# Altium schematic sheet main_control.SchDoc
size A4
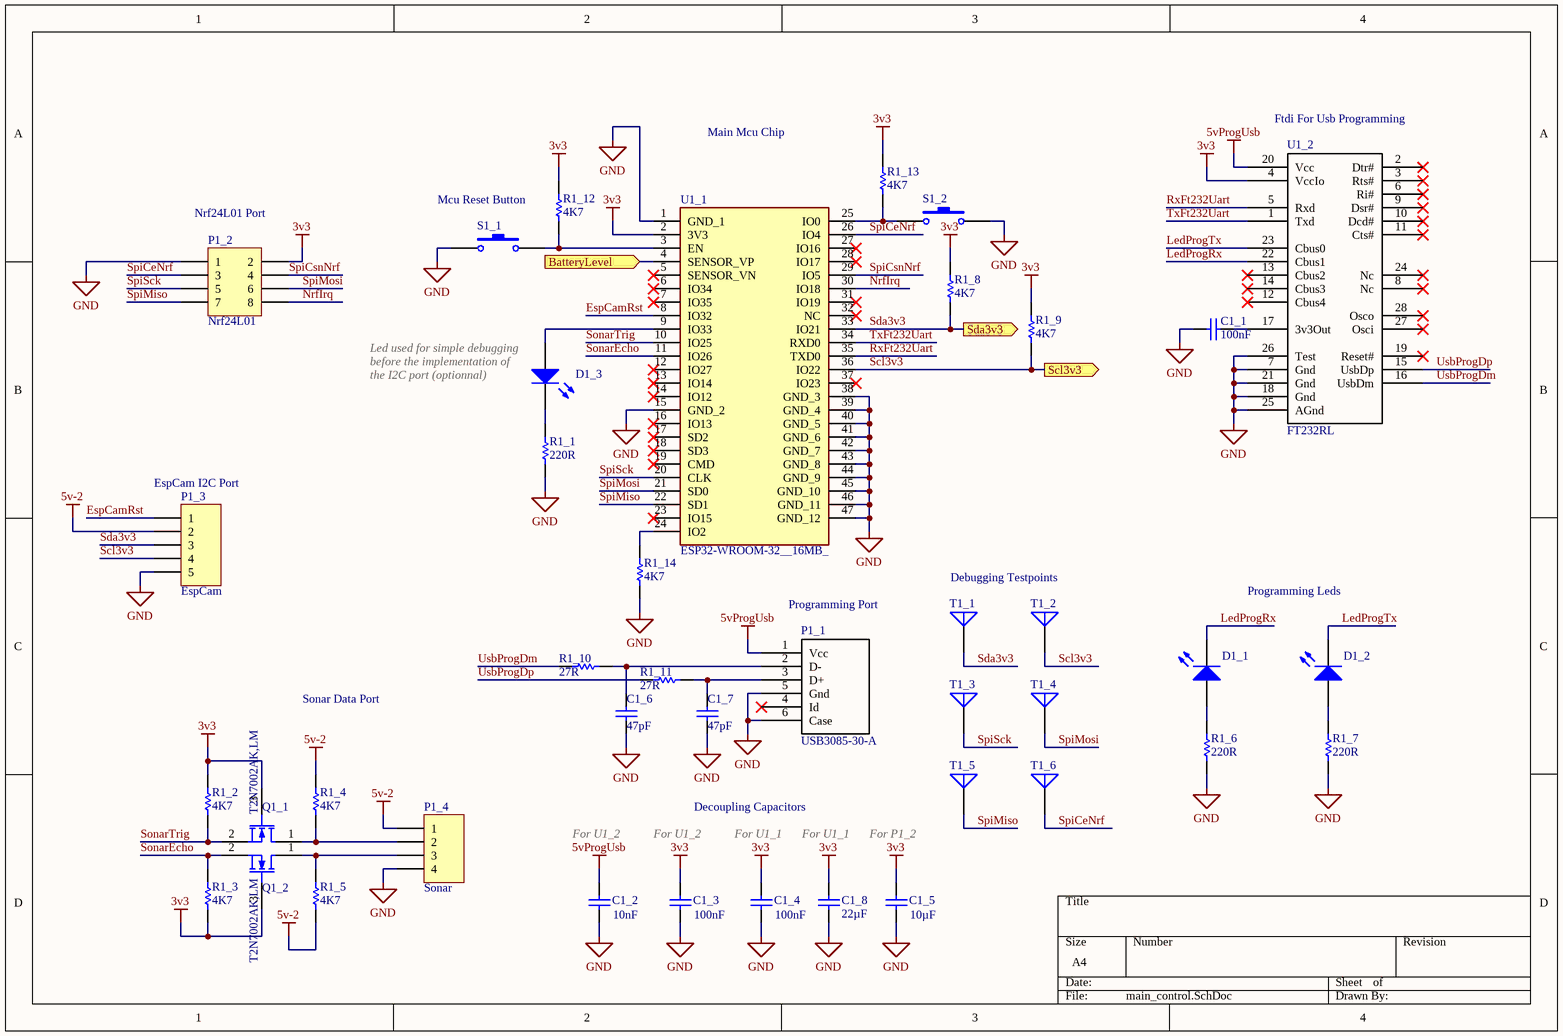
[diagram p0: main_control.SchDoc]

## Parts
C1_1  value 100nF  [C1206]  (hidden comment: 12063C104MAT2A)
C1_2  value 10nF  [C1206]  (hidden comment: C1206C103M5RACTU)
C1_3  value 100nF  [C1206]  (hidden comment: 12063C104MAT2A)
C1_4  value 100nF  [C1206]  (hidden comment: 12063C104MAT2A)
C1_5  value 10µF  [C1206]  (hidden comment: EMK316BJ106MLHT)
C1_6  value 47pF  [C1206]  (hidden comment: CML1206C0G470JT50V)
C1_7  value 47pF  [C1206]  (hidden comment: CML1206C0G470JT50V)
C1_8  value 22µF  [C1206]  (hidden comment: CL31A226KOHNNNE)
D1_1  LTST-C230KRKT  [C1206-POLARIZED]  (value not drawn)
D1_2  LTST-C230KRKT  [C1206-POLARIZED]  (value not drawn)
D1_3  APT3216QBC/D  [C1206-POLARIZED]  (value not drawn)
P1_1  USB3085-30-A  [USB-MICRO-CONNECTOR]
P1_2  Nrf24L01  [HDR2X4-42]
P1_3  EspCam  [HDR1X5-42]
P1_4  Sonar  [HDR1X4-42]
Q1_1  T2N7002AK,LM  [SOT23_L]
Q1_2  T2N7002AK,LM  [SOT23_L]
R1_1  value 220R  [C1206]  (hidden comment: Res1)
R1_2  value 4K7  [C1206]  (hidden comment: Res1)
R1_3  value 4K7  [C1206]  (hidden comment: Res1)
R1_4  value 4K7  [C1206]  (hidden comment: Res1)
R1_5  value 4K7  [C1206]  (hidden comment: Res1)
R1_6  value 220R  [C1206]  (hidden comment: Res1)
R1_7  value 220R  [C1206]  (hidden comment: Res1)
R1_8  value 4K7  [C1206]  (hidden comment: Res1)
R1_9  value 4K7  [C1206]  (hidden comment: Res1)
R1_10  value 27R  [C1206]  (hidden comment: Res1)
R1_11  value 27R  [C1206]  (hidden comment: Res1)
R1_12  value 4K7  [C1206]  (hidden comment: Res1)
R1_13  value 4K7  [C1206]  (hidden comment: Res1)
R1_14  value 4K7  [C1206]  (hidden comment: Res1)
S1_1  FSM4LPASTR  [SW4-SMT]  (value not drawn)
S1_2  FSM4LPASTR  [SW4-SMT]  (value not drawn)
T1_1  Mounting Hole  [TESTPOINT]  (value not drawn)
T1_2  Mounting Hole  [TESTPOINT]  (value not drawn)
T1_3  Mounting Hole  [TESTPOINT]  (value not drawn)
T1_4  Mounting Hole  [TESTPOINT]  (value not drawn)
T1_5  Mounting Hole  [TESTPOINT]  (value not drawn)
T1_6  Mounting Hole  [TESTPOINT]  (value not drawn)
U1_1  ESP32-WROOM-32__16MB_  [ESP32WROOM32D16MB]
U1_2  FT232RL  [SOP65P778X200-28N]

## Ports
BatteryLevel (in), Scl3v3 (out), Sda3v3 (out)

## Nets
3v3: C1_3.1 C1_4.1 C1_5.1 C1_8.1 P1_2.2 Q1_1.3(G) Q1_2.3(G) R1_2.1 R1_3.2 R1_8.1 R1_9.1 R1_12.2 R1_13.1 U1_1.2(3V3) U1_2.4(VccIo)
5v-2: P1_3.2 P1_4.1 R1_4.1 R1_5.2
5vProgUsb: C1_2.1 P1_1.1(Vcc) U1_2.20(Vcc)
GND: C1_1.2 C1_2.2 C1_3.2 C1_4.2 C1_5.2 C1_6.1 C1_7.2 C1_8.2 P1_1.5(Gnd) P1_1.6(Case) P1_2.1 P1_3.5 P1_4.4 R1_1.2 R1_6.2 R1_7.2 R1_14.2 S1_1.1 S1_2.2 U1_1.1(GND_1) U1_1.15(GND_2) U1_1.38(GND_3) U1_1.39(GND_4) U1_1.40(GND_5) U1_1.41(GND_6) U1_1.42(GND_7) U1_1.43(GND_8) U1_1.44(GND_9) U1_1.45(GND_10) U1_1.46(GND_11) U1_1.47(GND_12) U1_2.7(Gnd) U1_2.18(Gnd) U1_2.21(Gnd) U1_2.25(AGnd) U1_2.26(Test)
BatteryLevel: U1_1.4(SENSOR_VP) ; port BatteryLevel
EspCamRst: P1_3.1 U1_1.8(IO32)
LedProgRx: D1_1.2(K) U1_2.22(Cbus1)
LedProgTx: D1_2.2(K) U1_2.23(Cbus0)
NrfIrq: P1_2.8 U1_1.30(IO18)
RxFt232Uart: U1_1.35(TXD0) U1_2.5(Rxd)
Scl3v3: P1_3.4 R1_9.2 T1_2.1(A) U1_1.36(IO22) ; port Scl3v3
Sda3v3: P1_3.3 R1_8.2 T1_1.1(A) U1_1.33(IO21) ; port Sda3v3
SonarEcho: Q1_2.2(S) R1_3.1 U1_1.11(IO26)
SonarTrig: Q1_1.2(S) R1_2.2 U1_1.10(IO25)
SpiCeNrf: P1_2.3 T1_6.1(A) U1_1.26(IO4)
SpiCsnNrf: P1_2.4 U1_1.29(IO5)
SpiMiso: P1_2.7 T1_5.1(A) U1_1.22(SD1)
SpiMosi: P1_2.6 T1_4.1(A) U1_1.21(SD0)
SpiSck: P1_2.5 T1_3.1(A) U1_1.20(CLK)
TxFt232Uart: U1_1.34(RXD0) U1_2.1(Txd)
UsbProgDm: R1_10.1 U1_2.16(UsbDm)
UsbProgDp: R1_11.1 U1_2.15(UsbDp)
NetC1_1_1: C1_1.1 U1_2.17(3v3Out)
NetC1_6_2: C1_6.2 P1_1.2(D-) R1_10.2
NetC1_7_1: C1_7.1 P1_1.3(D+) R1_11.2
NetD1_1_1: D1_1.1(A) R1_6.1
NetD1_2_1: D1_2.1(A) R1_7.1
NetD1_3_1: D1_3.1(A) U1_1.9(IO33)
NetD1_3_2: D1_3.2(K) R1_1.1
NetP1_4_2: P1_4.2 Q1_1.1(D) R1_4.2
NetP1_4_3: P1_4.3 Q1_2.1(D) R1_5.1
NetR1_12_1: R1_12.1 S1_1.2 U1_1.3(EN)
NetR1_13_2: R1_13.2 S1_2.1 U1_1.25(IO0)
NetR1_14_1: R1_14.1 U1_1.24(IO2)

Not connected (* = marked no-connect by the designer): P1_1 4(Id)*; U1_1 5(SENSOR_VN)* 6(IO34)* 7(IO35)* 12(IO27)* 13(IO14)* 14(IO12)* 16(IO13)* 17(SD2)* 18(SD3)* 19(CMD)* 23(IO15)* 27(IO16)* 28(IO17)* 31(IO19)* 32(NC)* 37(IO23)*; U1_2 2(Dtr#)* 3(Rts#)* 6(Ri#)* 8(Nc)* 9(Dsr#)* 10(Dcd#)* 11(Cts#)* 12(Cbus4)* 13(Cbus2)* 14(Cbus3)* 19(Reset#)* 24(Nc)* 27(Osci)* 28(Osco)*

## Notes on the sheet
- Main Mcu Chip
- (near U1_2) Ftdi For Usb Programming
- (near P1_2) Nrf24L01 Port
- Mcu Reset Button
- (near D1_3) before the implementation of
- (near D1_3) Led used for simple debugging
- (near D1_3) the I2C port (optionnal)
- (near P1_3) EspCam I2C Port
- Debugging Testpoints
- (near P1_1) Programming Port
- Programming Leds
- Sonar Data Port
- For U1_2
- Decoupling Capacitors
- For U1_1
- For P1_2

## Library data of the parts
C1_1-C1_8 = Cap: Capacitor; Published: 8-Jun-2000; LatestRevisionDate: 17-Jul-2002; LatestRevisionNote: Re-released for DXP Platform.; PackageReference: RAD-0.3; Publisher: Altium Limited; PackageDescription: Radial Cap, Thru-Hole; 2 Leads; 0.3 in Pin Spacing
D1_1-D1_3 = LED0: Typical INFRARED GaAs LED; Published: 8-Jun-2000; LatestRevisionDate: 08-Jul-2005; LatestRevisionNote: Mech Layer 1 removed.; PackageReference: LED-0; Publisher: Altium Limited; PackageDescription: LED; 2 Leads
P1_1 = Usb Connector
P1_2 = Header 4X2: Header, 4-Pin, Dual row; LatestRevisionDate: 17-Jul-2002; LatestRevisionNote: Re-released for DXP Platform.; Publisher: Altium Limited
P1_3 = Header 5: Header, 5-Pin; LatestRevisionDate: 17-Jul-2002; LatestRevisionNote: Re-released for DXP Platform.; Publisher: Altium Limited
P1_4 = Header 4: Header, 4-Pin; LatestRevisionDate: 17-Jul-2002; LatestRevisionNote: Re-released for DXP Platform.; Publisher: Altium Limited
Q1_1 Q1_2 = MOSFET-N: N-Channel MOSFET; Published: 8-Jun-2000; LatestRevisionDate: 17-Jul-2002; LatestRevisionNote: Re-released for DXP Platform.; PackageVersion: 1995/1996; PackageReference: E3; Publisher: Altium Limited; PackageDescription: TO, Flat Index; 3 In-Line, Axial Leads; Body Dia. 4.6mm; Lead Dia. 0.5 mm (max)
R1_1-R1_14 = Res1: Resistor; Published: 8-Jun-2000; LatestRevisionDate: 17-Jul-2002; LatestRevisionNote: Re-released for DXP Platform.; PackageReference: AXIAL-0.3; Publisher: Altium Limited; PackageDescription: Axial Device, Thru-Hole; 2 Leads; 0.3 in Pin Spacing
S1_1 S1_2 = SW-PB: Switch; Published: 24-Mar-1999; LatestRevisionDate: 17-Jul-2002; LatestRevisionNote: Re-released for DXP Platform.; PackageReference: SPST-2; Publisher: Altium Limited; PackageDescription: Switch; 2 Leads
T1_1-T1_6 = Antenna: Generic Antenna; Published: 24-Mar-1999; LatestRevisionDate: 17-Jul-2002; LatestRevisionNote: Re-released for DXP Platform.; PackageReference: PIN1; Publisher: Altium Limited
U1_1 = ESP32-WROOM-32__16MB_: Integrated Circuit; Manufacturer_Name: Espressif Systems; Manufacturer_Part_Number: ESP32-WROOM-32 (16MB); Datasheet Link: https://www.espressif.com/sites/default/files/documentation/esp32_datasheet_en.pdf; Height: 3.2mm; Mouser Part Number: 356-ESPWROOM3216MB; Mouser Price/Stock: https://www.mouser.co.uk/ProductDetail/Espressif-Systems/ESP32-WROOM-32-16MB?qs=w%2Fv1CP2dgqrcPyEPuQvO1A%3D%3D
U1_2 = Ft232